# Altium schematic sheet RF_switch_ckt.SchDoc
size OrCAD E
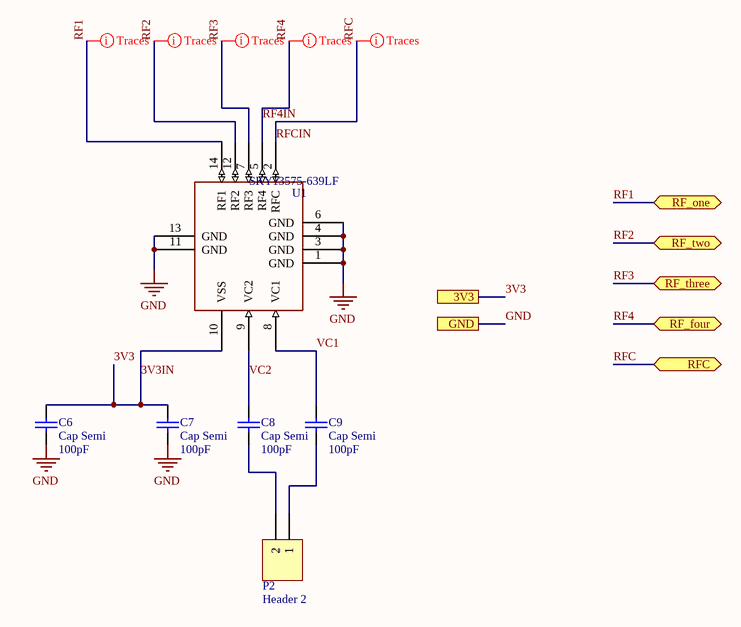
[diagram p0: RF_switch_ckt.SchDoc]

## Parts
C6  Cap Semi  value 100pF  [0402]
C7  Cap Semi  value 100pF  [0402]
C8  Cap Semi  value 100pF  [0402]
C9  Cap Semi  value 100pF  [0402]
P2  Header 2  [HDR1X2]
U1  SKY13575-639LF  [*QFN45P200X200X55-15N]

## Ports
3V3, GND, RF_four (bidir), RF_one (bidir), RF_three (bidir), RF_two (bidir), RFC (bidir)

## Nets
GND: C6.1 C7.1 U1.1(GND) U1.3(GND) U1.4(GND) U1.6(GND) U1.11(GND) U1.13(GND) ; port GND
3V3: C6.2 C7.2 U1.10(VSS) ; port 3V3  [also labelled 3V3IN]
RF1: U1.14(RF1) ; port RF_one
RF2: U1.12(RF2) ; port RF_two
RF3: U1.7(RF3) ; port RF_three
RF4: U1.5(RF4) ; port RF_four  [also labelled RF4IN]
RFC: U1.2(RFC) ; port RFC  [also labelled RFCIN]
VC1: C9.2 U1.8(VC1)
VC2: C8.2 U1.9(VC2)
NetC8_1: C8.1 P2.2
NetC9_1: C9.1 P2.1

## Layout directives
rule Width Constraint [Pref Width = 11.283mil    Min Width = 11.283mil    Max Width = 11.283mil]; rule Clearance Constraint [Generic clearance = 2mil, and 21 value(s) for objects]: RF1
rule Width Constraint [Pref Width = 11.283mil    Min Width = 11.283mil    Max Width = 11.283mil]; rule Clearance Constraint [Generic clearance = 5mil, and 5 value(s) for objects]: RF2, RF3, RF4, RFC

## Library data of the parts
C6-C9 = Cap Semi: Capacitor (Semiconductor SIM Model); Published: 8-Jun-2000; LatestRevisionDate: 29-May-2009; LatestRevisionNote: IPC-7351 Footprint Added.; PackageReference: C1206; Publisher: Altium Limited; PackageDescription: Chip Capacitor
P2 = Header 2: Header, 2-Pin; LatestRevisionDate: 17-Jul-2002; LatestRevisionNote: Re-released for DXP Platform.; Publisher: Altium Limited